# EAGLE schematic LoadBoard (EAGLE 6.5.0)
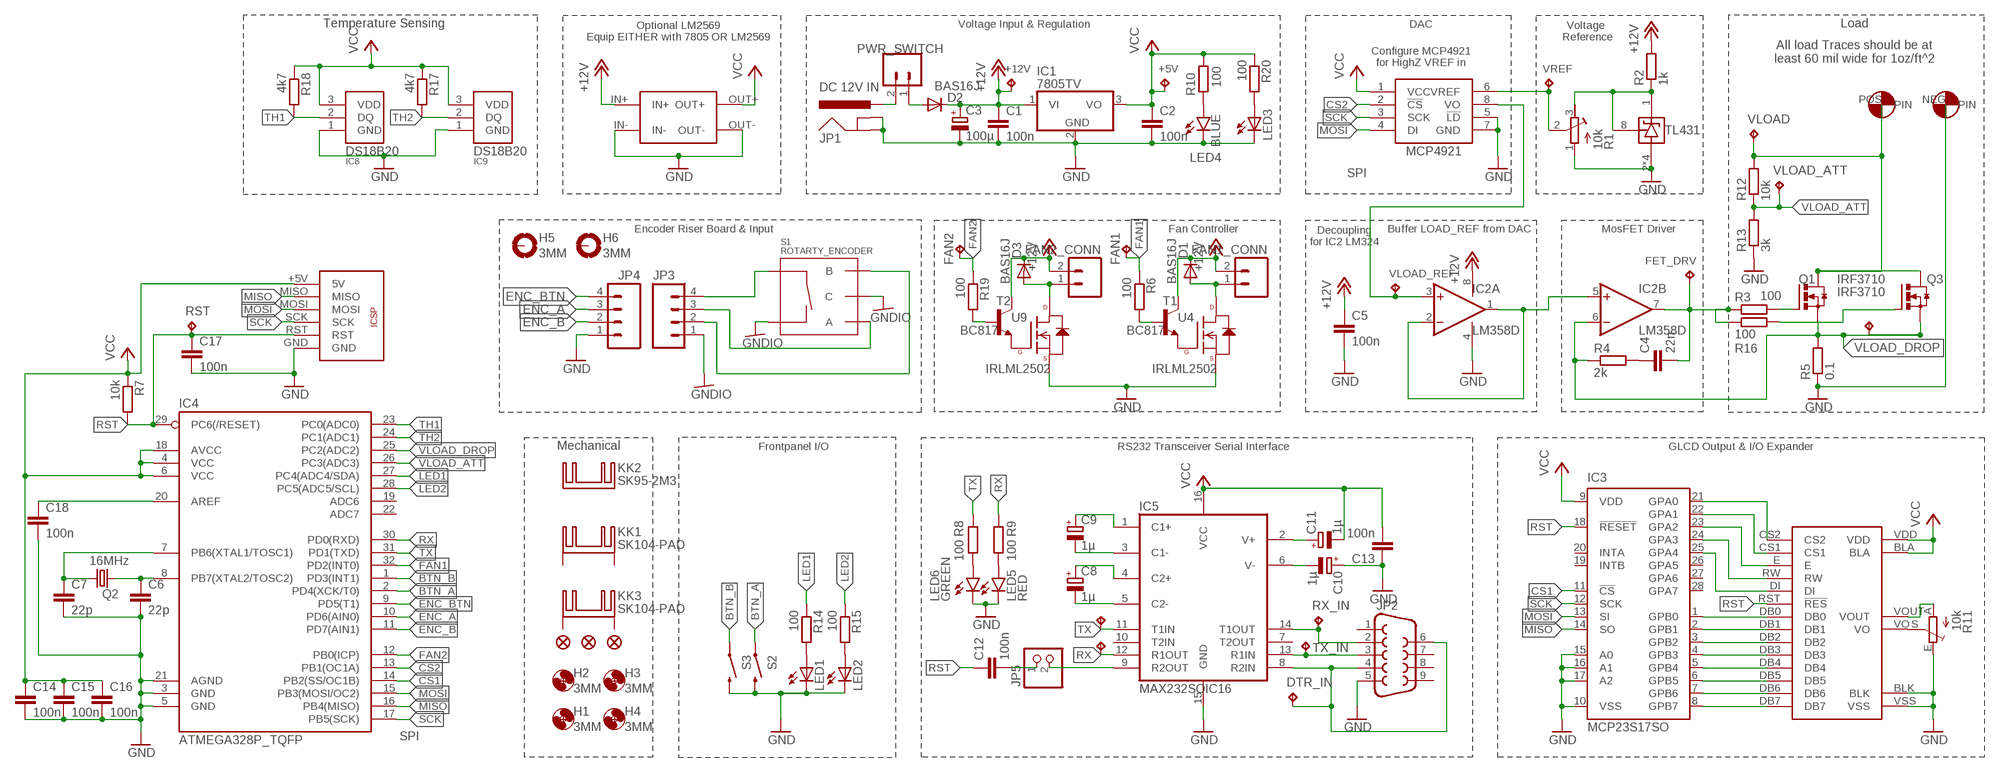
[diagram p0: schematic, sheet 1]

## Parts
+5V  TPB1,27  [B1,27]
+12V  TPB1,27  [B1,27]
C1  100n  C-EUC1206K  [C1206K]
C2  100n  C-EUC1206K  [C1206K]
C3  100µ  CPOL-EU175TMP-0808  [175TMP-0808]
C4  22n  C-EUC1206  [C1206]
C5  100n  C-EUC1206K  [C1206K]
C6  22p  C-EUC1206K  [C1206K]
C7  22p  C-EUC1206K  [C1206K]
C8  1µ  CPOL-EU153CLV-0405  [153CLV-0405]
C9  1µ  CPOL-EU153CLV-0405  [153CLV-0405]
C10  1µ  CPOL-EU153CLV-0405  [153CLV-0405]
C11  1µ  CPOL-EU153CLV-0405  [153CLV-0405]
C12  100n  C-EUC1206K  [C1206K]
C13  100n  C-EUC1206K  [C1206K]
C14  100n  C-EUC1206K  [C1206K]
C15  100n  C-EUC1206K  [C1206K]
C16  100n  C-EUC1206K  [C1206K]
C17  100n  C-EUC1206K  [C1206K]
C18  100n  C-EUC1206K  [C1206K]
D1  BAS16J  DIODE-SOD323-W  [SOD323-W]
D2  BAS16J  DIODE-SOD323-W  [SOD323-W]
D3  BAS16J  DIODE-SOD323-W  [SOD323-W]
DTR_IN  TPB1,27  [B1,27]
FAN1  TPB1,27  [B1,27]
FAN1_CONN  M02POLAR  [MOLEX-1X2]
FAN2  TPB1,27  [B1,27]
FAN2_CONN  M02POLAR  [MOLEX-1X2]
FET_DRV  TPB1,27  [B1,27]
FID1  FIDUCIAL1X2  [FIDUCIAL-1X2]
FID2  FIDUCIAL1X2  [FIDUCIAL-1X2]
FID3  FIDUCIAL1X2  [FIDUCIAL-1X2]
H1  3MM  MOUNT-HOLE3.0  [3,0]
H2  3MM  MOUNT-HOLE3.0  [3,0]
H3  3MM  MOUNT-HOLE3.0  [3,0]
H4  3MM  MOUNT-HOLE3.0  [3,0]
H5  3MM  MOUNT-PAD-ROUND3.0  [3,0-PAD]
H6  3MM  MOUNT-PAD-ROUND3.0  [3,0-PAD]
IC1  7805TV  [TO220V]
IC2  LM358D  [SO08]
IC3  MCP23S17SO  [SO28W]
IC4  ATMEGA328P_TQFP  [TQFP32-08]
IC5  MAX232SOIC16  [SO016]
IC6  MCP4921  [SO-8]
IC7  TL431CD  [SO-8]
IC8  DS18B20  [TO-92]
IC9  DS18B20  [TO-92]
JP1  DC 12V IN  POWER_JACKPTH  [POWER_JACK_PTH]
JP2  DB9FEMALE  [DB9]
JP3  M04POLAR  [MOLEX-1X4]
JP4  M04POLAR  [MOLEX-1X4]
JP5  PINHD-1X2  [1X02]
KK1  SK104-PAD  [SK104-PAD]
KK2  SK95-2M3  [SK95-2M3]
KK3  SK104-PAD  [SK104-PAD]
LED1  LEDB155  [Q62902-B155]
LED2  LEDB155  [Q62902-B155]
LED3  LEDB155  [Q62902-B155]
LED4  BLUE  LED0603  [LED-0603]
LED5  RED  LED0603  [LED-0603]
LED6  GREEN  LED0603  [LED-0603]
PWR_SWITCH  M02POLAR  [MOLEX-1X2]
Q1  IRF3710  IRFZ44N  [TO-220-V]
Q2  16MHz  CRYSTALHC49UP  [HC49UP]
Q3  IRF3710  IRFZ44N  [TO-220-V]
R1  10k  R-TRIMM3296Y  [RTRIM3296Y]
R2  1k  R-EU_M1206  [M1206]
R3  100  R-EU_R1206  [R1206]
R4  2k  R-EU_R1206  [R1206]
R5  0.1  R-EU_VTA52  [VTA52]
R6  100  R-EU_R1206  [R1206]
R7  10k  R-EU_R1206  [R1206]
R8  100  R-EU_R1206  [R1206]
R9  100  R-EU_R1206  [R1206]
R10  100  R-EU_R1206  [R1206]
R11  10k  TRIM_EU-RS3  [RS3]
R12  10k  R-EU_R1206  [R1206]
R13  3k  R-EU_R1206  [R1206]
R14  100  R-EU_R1206  [R1206]
R15  100  R-EU_R1206  [R1206]
R16  100  R-EU_R1206  [R1206]
R17  4k7  R-EU_M1206  [M1206]
R18  4k7  R-EU_M1206  [M1206]
R19  100  R-EU_R1206  [R1206]
R20  100  R-EU_R1206  [R1206]
RST  TPB1,27  [B1,27]
RX  TPB1,27  [B1,27]
RX_IN  TPB1,27  [B1,27]
S1  ROTARTY_ENCODER  [ROTARY_ENC_PLAIN]
S2  SWITCH-MOMENTARY-2SIDE_EZ  [TACTILE-PTH-SIDEEZ]
S3  SWITCH-MOMENTARY-2SIDE_EZ  [TACTILE-PTH-SIDEEZ]
T1  BC817  BC817-NPN-SOT23-BEC  [SOT23-BEC]
T2  BC817  BC817-NPN-SOT23-BEC  [SOT23-BEC]
TX  TPB1,27  [B1,27]
TX_IN  TPB1,27  [B1,27]
U4  IRLML2502  N-CHANNEL-MOSFET-BSS138  [SOT23-3]
U9  IRLML2502  N-CHANNEL-MOSFET-BSS138  [SOT23-3]
U$3  CON-2-HIGAMP  [CON-HIGHAMP-0.3"]
U$5  ICSPTHROUGHHOLE  [ICSP-THROUGHHOLE]
U$6  KS0108-GLCDS6B0108  [KS0108-S6B0108-GLCD]
U$10  LM2569NO_OUTLINE  [LM2596_NO_OUTLINE]
VLOAD  TPB1,27  [B1,27]
VLOAD_ATT  TPB1,27  [B1,27]
VLOAD_DROP  TPB1,27  [B1,27]
VLOAD_REF  TPB1,27  [B1,27]
VREF  TPB1,27  [B1,27]

## Nets
+12V: +12V.TP C1.1 C3.+ C5.1 D1.C D2.C D3.C FAN1_CONN.2 FAN2_CONN.2 IC1.1(VI) IC2.8(P:V+) R2.2 T1.C T2.C U$10.IN+
BTN_A: IC4.2(PD4(XCK/T0)) S2.1
BTN_B: IC4.1(PD3(INT1)) S3.1
CS1: IC3.11(!CS) IC4.14(PB2(SS/OC1B))
CS2: IC4.13(PB1(OC1A)) IC6.2(!CS!)
ENC_A: IC4.10(PD6(AIN0)) JP4.3
ENC_B: IC4.11(PD7(AIN1)) JP4.2
ENC_BTN: IC4.9(PD5(T1)) JP4.4
FAN1: FAN1.TP IC4.32(PD2(INT0)) R6.1
FAN2: FAN2.TP IC4.12(PB0(ICP)) R19.1
GND: C1.2 C2.2 C3.- C5.2 C6.2 C7.2 C10.+ C13.1 C14.2 C15.2 C16.2 C17.2 C18.2 IC1.2(GND) IC2.4(P:V-) IC3.10(VSS) IC3.15(A0) IC3.16(A1) IC3.17(A2) IC4.3(GND) IC4.5(GND) IC4.21(AGND) IC5.15(GND) IC6.5(!LD!) IC6.7(GND) IC7.2(ANODE) IC7.3(ANODE) IC7.6(ANODE) IC7.7(ANODE) IC8.1(GND) IC9.1(GND) JP1.GND JP1.GNDBREAK JP2.5 JP4.1 LED1.K(C) LED2.K(C) LED3.K(C) LED4.C LED5.C LED6.C R1.1(A) R5.1 R11.E R13.1 S2.2 S3.2 U4.2(S) U9.2(S) U$3.NEG U$5.GND U$6.BLK U$6.VSS U$10.IN- U$10.OUT-
GNDIO: JP3.1 S1.C S1.SW-
LED1: IC4.27(PC4(ADC4/SDA)) R14.1
LED2: IC4.28(PC5(ADC5/SCL)) R15.1
LOAD+: Q1.2(D) Q3.2(D) R12.2 U$3.POS VLOAD.TP
MISO: IC3.14(SO) IC4.16(PB4(MISO)) U$5.MISO
MOSI: IC3.13(SI) IC4.15(PB3(MOSI/OC2)) IC6.4(DI) U$5.MOSI
N$1: IC7.1(CATHODE) IC7.8(REF) R1.3(E) R2.1
N$2: IC6.6(VREF) R1.2(S) VREF.TP
N$3: C4.1 R4.2
N$4: T1.E U4.1(G)
N$5: D1.A FAN1_CONN.1 U4.3(D)
N$6: Q1.1(G) R3.2
N$7: IC5.9(R2OUT) JP5.2
N$8: R6.2 T1.B
N$9: C7.1 IC4.7(PB6(XTAL1/TOSC1)) Q2.1
N$10: C4.2 FET_DRV.TP IC2.7(B:OUT) R3.1 R16.1
N$11: C6.1 IC4.8(PB7(XTAL2/TOSC2)) Q2.2
N$12: DTR_IN.TP IC5.8(R2IN) JP2.4 JP2.6
N$13: IC5.14(T1OUT) JP2.2 RX_IN.TP
N$14: IC5.13(R1IN) JP2.3 TX_IN.TP
N$15: C9.- IC5.3(C1-)
N$16: C9.+ IC5.1(C1+)
N$17: C8.- IC5.5(C2-)
N$18: C8.+ IC5.4(C2+)
N$19: C11.+ IC5.2(V+)
N$20: LED4.A R10.2
N$21: C10.- IC5.6(V-)
N$22: LED6.A R8.2
N$23: LED5.A R9.2
N$24: R11.S U$6.VO
N$25: R11.A U$6.VOUT
N$26: JP1.PWR PWR_SWITCH.2
N$27: IC3.1(GPB0) U$6.DB0
N$28: IC3.2(GPB1) U$6.DB1
N$29: IC3.3(GPB2) U$6.DB2
N$30: IC3.4(GPB3) U$6.DB3
N$31: IC3.5(GPB4) U$6.DB4
N$32: IC3.6(GPB5) U$6.DB5
N$33: IC3.7(GPB6) U$6.DB6
N$34: IC3.8(GPB7) U$6.DB7
N$35: IC3.21(GPA0) U$6.CS2
N$36: IC3.22(GPA1) U$6.CS1
N$37: IC3.23(GPA2) U$6.E
N$38: IC3.24(GPA3) U$6.RW
N$39: IC3.25(GPA4) U$6.DI
N$40: C18.1 IC4.20(AREF)
N$41: D2.A PWR_SWITCH.1
N$42: T2.E U9.1(G)
N$43: LED1.A R14.2
N$44: LED2.A R15.2
N$45: JP3.4 S1.SW+
N$46: JP3.3 S1.A
N$47: Q3.1(G) R16.2
N$48: R19.2 T2.B
N$49: JP3.2 S1.B
N$50: D3.A FAN2_CONN.1 U9.3(D)
N$51: LED3.A R20.2
RST: C12.1 C17.1 IC3.18(!RESET) IC4.29(PC6(/RESET)) R7.2 RST.TP U$5.RST U$6.RST(!RES!)
RST_EN: C12.2 JP5.1
RX: IC4.30(PD0(RXD)) IC5.12(R1OUT) R9.1 RX.TP
SCK: IC3.12(SCK) IC4.17(PB5(SCK)) IC6.3(SCK) U$5.SCK
TH1: IC4.23(PC0(ADC0)) IC8.2(DQ) R18.2
TH2: IC4.24(PC1(ADC1)) IC9.2(DQ) R17.2
TX: IC4.31(PD1(TXD)) IC5.11(T1IN) R8.1 TX.TP
VCC: +5V.TP C2.1 C11.- C13.2 C14.1 C15.1 C16.1 IC1.3(VO) IC3.9(VDD) IC4.4(VCC) IC4.6(VCC) IC4.18(AVCC) IC5.16(VCC) IC6.1(VCC) IC8.3(VDD) IC9.3(VDD) R7.1 R10.1 R17.1 R18.1 R20.1 U$5.+5V(5V) U$6.BLA U$6.VDD U$10.OUT+
VLOAD_ATT: IC4.26(PC3(ADC3)) R12.1 R13.2 VLOAD_ATT.TP
VLOAD_DROP: IC2.6(B:-IN) IC4.25(PC2(ADC2)) Q1.3(S) Q3.3(S) R4.1 R5.2 VLOAD_DROP.TP
VLOAD_REF: IC2.3(A:+IN) IC6.8(VO) VLOAD_REF.TP
VREF_BUF: IC2.1(A:OUT) IC2.2(A:-IN) IC2.5(B:+IN)
Unconnected: H5.B3,0(MOUNT) H6.B3,0(MOUNT) IC3.19(INTB) IC3.20(INTA) IC3.26(GPA5) IC3.27(GPA6) IC3.28(GPA7) IC4.19(ADC6) IC4.22(ADC7) IC5.7(T2OUT) IC5.10(T2IN) JP2.1 JP2.7 JP2.8 JP2.9 KK1.K1(K) KK1.K2(K) KK3.K1(K) KK3.K2(K)

## Notes on the sheet
- Temperature Sensing | Voltage Input & Regulation | DAC | Load
- Optional LM2569
  Equip EITHER with 7805 OR LM2569
- Voltage 
  Reference
- All load Traces should be at 
  least 60 mil wide for 1oz/ft^2
- Configure MCP4921
  for HighZ VREF in
- SPI
- Encoder Riser Board & Input | Fan Controller | Buffer LOAD_REF from DAC | MosFET Driver
- Decoupling
  for IC2 LM324
- Mechanical | Frontpanel I/O | RS232 Transceiver Serial Interface | GLCD Output & I/O Expander
- SPI

## Library data of the parts
+5V +12V DTR_IN FAN1 FAN2 FET_DRV RST RX RX_IN TX TX_IN VLOAD VLOAD_ATT VLOAD_DROP VLOAD_REF VREF = testpad:TP: Test pad
C1 C2 C4-C7 C12-C18 = rcl:C-EU: CAPACITOR, European symbol
C3 C8-C11 = rcl:CPOL-EU: POLARIZED CAPACITOR, European symbol
D1-D3 = diode:DIODE-: DIODE
FAN1_CONN FAN2_CONN PWR_SWITCH = SparkFun-Connectors:M02: Standard 2-pin 0.1" header. Use with - straight break away headers ( PRT-00116) - right angle break away headers (PRT-00553) - swiss pins (PRT-00743) - machine pins (PRT-00117) - female headers (PRT-00115) Molex polarized connector foot print use with: PRT-08233 with associated crimp pins and housings. 2.54_SCREWTERM for use with PRT-10571. 3.5mm Screw Terminal footprints for PRT-08084 5mm Screw Terminal footprints for use with PRT-08432
FID1-FID3 = SparkFun-Aesthetics:FIDUCIAL: Fiducial Alignment Points Various fiducial points for machine vision alignment.
H1-H4 = holes:MOUNT-HOLE: MOUNTING HOLE with drill center marker
H5 H6 = holes:MOUNT-PAD-ROUND: MOUNTING PAD, round
IC1 = linear:78*: Positive VOLTAGE REGULATOR Source: http://cache.national.com/ds/LM/LM78L05.pdf http://www.fairchildsemi.com/ds/LM/LM7805.pdf
IC2 = linear:LM358: OP AMP also LM158; LM258; LM2904 Source: http://cache.national.com/ds/LM/LM158.pdf
IC3 = microchip:MCP23S17: http://ww1.microchip.com/downloads/en/DeviceDoc/21952a.pdf Source: http://ww1.microchip.com/downloads/en/DeviceDoc/21952a.pdf; MF: MICROCHIP; MPN: MCP23S17-E/SO; OC_FARNELL: unknown; OC_NEWARK: 31K2950
IC4 = SparkFun-DigitalIC:ATMEGA328P_TQFP; PROD_ID: IC-09069
IC5 = SparkFun-DigitalIC:MAX232: RS232 Transceiver Very common IC. This is generically called 'MAX232', but works with the 3V equivalent MAX3232 generic ICs. Field tested and mother approved. Spark Fun Electronics SKU : COM-00316 (DIP) and COM-00589 (SMD); PROD_ID: IC-08171
IC6 = OwnStuff:MCP4921
IC7 = OwnStuff:TL431
IC8 IC9 = OwnStuff:DS18B20
JP1 = SparkFun-Connectors:POWER_JACK: Power Jack This is the standard 5.5mm barrel jack for power. The PTH is the most common, proven, reliable, footprint. The Slot footprint only works if the mill layer is transmitted to the PCB fab house so be warned. Mating wall wart : TOL-00298 (and others); PROD_ID: CONN-08197
JP2 = SparkFun-Connectors:DB9: DB9 Connector Standard DB9 (D-Sub 9) serial connector. Can be used for CAN bus as well as RS485 and RS232. Footprint production proven. Spark Fun Electronics SKU : PRT-00429; PROD_ID: CONN-08194
JP3 JP4 = SparkFun-Connectors:M04: Header 4 Standard 4-pin 0.1" header. Use with straight break away headers (SKU : PRT-00116), right angle break away headers (PRT-00553), swiss pins (PRT-00743), machine pins (PRT-00117), and female headers (PRT-00115). Molex polarized connector foot print use with SKU : PRT-08231 with associated crimp pins and housings. 1MM SMD Version SKU: PRT-10208
JP5 = pinhead:PINHD-1X2: PIN HEADER
KK1 KK3 = heatsink:SK104-PAD: HEATSINK manufacturer Fischer/distributor Buerklin
KK2 = heatsink:SK95-2M3: HEATSINK manufacturer Fischer/distributor Buerklin
LED1-LED3 = led:LED: LED OSRAM: - CHIPLED LG R971, LG N971, LY N971, LG Q971, LY Q971, LO R971, LY R971 LH N974, LH R974 LS Q976, LO Q976, LY Q976 LO Q996 - Hyper CHIPLED LW Q18S LB Q993, LB Q99A, LB R99A - SideLED LS A670, LO A670, LY A670, LG A670, LP A670 LB A673, LV A673, LT A673, LW A673 LH A674 LY A675 LS A676, LA A676, LO A676, LY A676, LW A676 LS A679, LY A679, LG A679 - Hyper Micro SIDELED® LS Y876, LA Y876, LO Y876, LY Y876 LT Y87S - SmartLED LW L88C, LW L88S LB L89C, LB L89S, LG L890 LS L89K, LO L89K, LY L89K LS L896, LA L896, LO L896, LY L896 - TOPLED LS T670, LO T670, LY T670, LG T670, LP T670 LSG T670, LSP T670, LSY T670, LOP T670, LYG T670 LG T671, LOG T671, LSG T671 LB T673, LV T673, LT T673, LW T673 LH T674 LS T676, LA T676, LO T676, LY T676, LB T676, LH T676, LSB T676, LW T676 LB T67C, LV T67C, LT T67C, LS T67K, LO T67K, LY T67K, LW E67C LS E67B, LA E67B, LO E67B, LY E67B, LB E67C, LV E67C, LT E67C LW T67C LS T679, LY T679, LG T679 LS T770, LO T770, LY T770, LG T770, LP T770 LB T773, LV T773, LT T773, LW T773 LH T774 LS E675, LA E675, LY E675, LS T675 LS T776, LA T776, LO T776, LY T776, LB T776 LHGB T686 LT T68C, LB T68C - Hyper Mini TOPLED® LB M676 - Mini TOPLED Santana® LG M470 LS M47K, LO M47K, LY M47K Source: http://www.osram.convergy.de LUXEON: - LUMILED® LXK2-PW12-R00, LXK2-PW12-S00, LXK2-PW14-U00, LXK2-PW14-V00 LXK2-PM12-R00, LXK2-PM12-S00, LXK2-PM14-U00 LXK2-PE12-Q00, LXK2-PE12-R00, LXK2-PE12-S00, LXK2-PE14-T00, LXK2-PE14-U00 LXK2-PB12-K00, LXK2-PB12-L00, LXK2-PB12-M00, LXK2-PB14-N00, LXK2-PB14-P00, LXK2-PB14-Q00 LXK2-PR12-L00, LXK2-PR12-M00, LXK2-PR14-Q00, LXK2-PR14-R00 LXK2-PD12-Q00, LXK2-PD12-R00, LXK2-PD12-S00 LXK2-PH12-R00, LXK2-PH12-S00 LXK2-PL12-P00, LXK2-PL12-Q00, LXK2-PL12-R00 Source: www.luxeon.com KINGBRIGHT: KA-3528ASYC Source: www.kingbright.com
LED4-LED6 = SparkFun-LED:LED: LEDs Standard schematic elements and footprints for 5mm, 3mm, 1206, and 0603 sized LEDs. 5mm - Spark Fun Electronics SKU : COM-00529 (and others)
Q1 Q3 = OwnStuff:IRFZ44N
Q2 = crystal:CRYSTAL: CRYSTAL; OC_FARNELL: unknown; OC_NEWARK: unknown
R1 = rcl:R-TRIMM: Trimm resistor
R2-R10 R12-R20 = rcl:R-EU_: RESISTOR, European symbol
R11 = pot:TRIM_EU-: POTENTIOMETER
S1 = SparkFun-Electromechanical:ROTARTY_ENCODER: Simple no LED rotary encoder Example: COM-09117
S2 S3 = SparkFun-Electromechanical:SWITCH-MOMENTARY-2: Various NO switches- pushbuttons, reed, etc
T1 T2 = transistor:*-NPN-: NPN Transistror BF959 corrected 2008.03.06
U4 U9 = GeekAmmo:N-CHANNEL-MOSFET: N-Channel MOSFET Mode Field Effect Transistor; DATASHEET: http://www.fairchildsemi.com/ds/BS/BSS138.pdf; DIGIKEY: BSS138TR-ND; ELEMENT14: 2323154; URL: http://au.element14.com/fairchild-semiconductor/bss138/mosfet-n-ch-50v-220ma-sot-23/dp/2323154
U$3 = OwnStuff:CON-2-HIGAMP
U$5 = OwnStuff:ICSP
U$6 = OwnStuff:KS0108-GLCD
U$10 = OwnStuff:LM2569